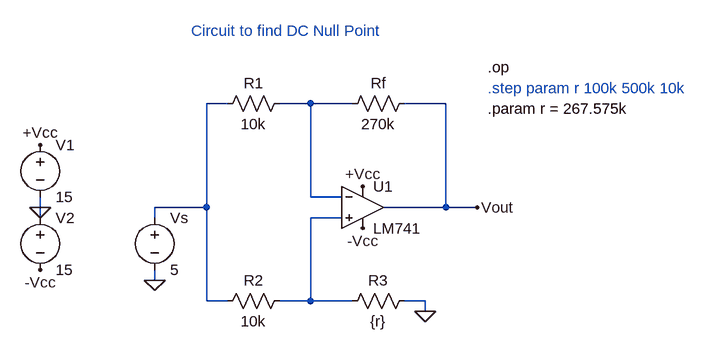
[diagram p0: schematic DCNullP.asc]
DCNullP.asc, the LTspice schematic file:
Version 4
SHEET 1 1064 680
WIRE 288 32 256 32
WIRE 416 32 368 32
WIRE 480 32 416 32
WIRE 624 32 560 32
WIRE 416 176 416 32
WIRE 464 176 416 176
WIRE 0 192 0 176
WIRE 256 192 256 32
WIRE 256 192 176 192
WIRE 624 192 624 32
WIRE 624 192 528 192
WIRE 672 192 624 192
WIRE 0 208 0 192
WIRE 176 208 176 192
WIRE 464 208 416 208
WIRE 176 304 176 288
WIRE 256 336 256 192
WIRE 288 336 256 336
WIRE 416 336 416 208
WIRE 416 336 368 336
WIRE 480 336 416 336
WIRE 592 336 560 336
WIRE 592 352 592 336
FLAG 0 192 0
FLAG 0 96 +Vcc
FLAG 0 288 -Vcc
FLAG 592 352 0
FLAG 176 304 0
FLAG 672 192 Vout
FLAG 496 160 +Vcc
FLAG 496 224 -Vcc
SYMBOL voltage 0 192 R0
SYMATTR InstName V2
SYMATTR Value 15
SYMBOL voltage 0 80 R0
SYMATTR InstName V1
SYMATTR Value 15
SYMBOL Opamps\\LM741 496 128 R0
SYMATTR InstName U1
SYMBOL res 384 16 R90
WINDOW 0 0 56 VBottom 2
WINDOW 3 32 56 VTop 2
SYMATTR InstName R1
SYMATTR Value 10k
SYMBOL res 384 320 R90
WINDOW 0 0 56 VBottom 2
WINDOW 3 32 56 VTop 2
SYMATTR InstName R2
SYMATTR Value 10k
SYMBOL res 576 320 R90
WINDOW 0 0 56 VBottom 2
WINDOW 3 32 56 VTop 2
SYMATTR InstName R3
SYMATTR Value {r}
SYMBOL voltage 176 192 R0
SYMATTR InstName Vs
SYMATTR Value 5
SYMBOL res 576 16 R90
WINDOW 0 0 56 VBottom 2
WINDOW 3 32 56 VTop 2
SYMATTR InstName Rf
SYMATTR Value 270k
TEXT 688 -24 Left 2 !.op
TEXT 688 8 Left 2 ;.step param r 100k 500k 10k
TEXT 232 -80 Left 2 ;Circuit to find DC Null Point
TEXT 688 40 Left 2 !.param r = 267.575k

The netlist it stands for:
* DCNullP.asc
V2 0 -Vcc 15
V1 +Vcc 0 15
XU1 N003 N002 +Vcc -Vcc Vout LM741  ; pins In+ In- V+ V- OUT
R1 N002 N001 10k
R2 N003 N001 10k
R3 0 N003 {r}
Vs N001 0 5
Rf Vout N002 270k
.op
* .step param r 100k 500k 10k
* Circuit to find DC Null Point
.param r = 267.575k
.lib LM741.lib
.backanno
.end